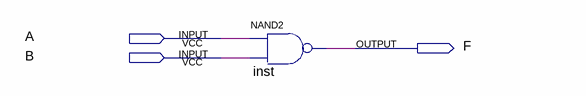
[diagram p0: schematic sheet]
// Quartus schematic NAND_2.bdf as structural Verilog: 1 symbols, 3 pins
module NAND_2 (
  input  A,
  input  B,
  output F
);

  nand inst (F, A, B);
endmodule
